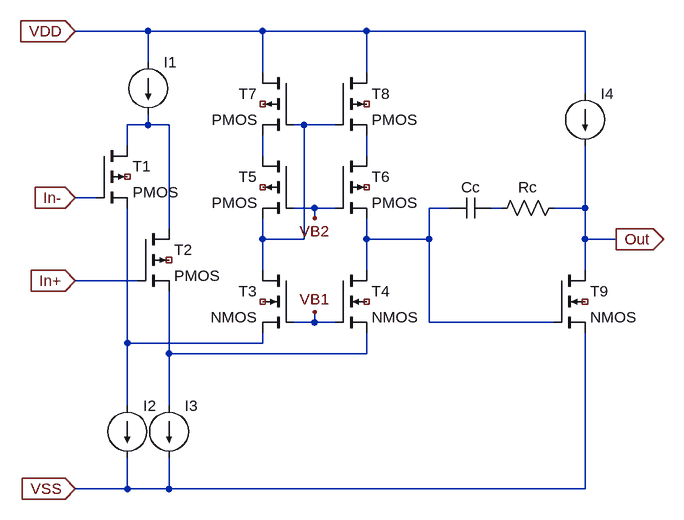
[diagram p0: schematic topology.asc]
topology.asc, the LTspice schematic file:
Version 4
SHEET 1 1204 680
WIRE 384 -176 272 -176
WIRE 560 -176 384 -176
WIRE 720 -176 560 -176
WIRE 1056 -176 720 -176
WIRE 384 -128 384 -176
WIRE 560 -112 560 -176
WIRE 720 -112 720 -176
WIRE 1056 -80 1056 -176
WIRE 384 -32 384 -48
WIRE 384 -32 352 -32
WIRE 416 -32 384 -32
WIRE 624 -32 608 -32
WIRE 672 -32 624 -32
WIRE 352 0 352 -32
WIRE 560 16 560 -16
WIRE 720 16 720 -16
WIRE 304 80 272 80
WIRE 640 96 608 96
WIRE 672 96 640 96
WIRE 848 96 816 96
WIRE 928 96 912 96
WIRE 1056 96 1056 0
WIRE 1056 96 1008 96
WIRE 640 112 640 96
WIRE 416 128 416 -32
WIRE 560 144 560 112
WIRE 624 144 624 -32
WIRE 624 144 560 144
WIRE 720 144 720 112
WIRE 816 144 816 96
WIRE 816 144 720 144
WIRE 1056 144 1056 96
WIRE 1104 144 1056 144
WIRE 560 192 560 144
WIRE 720 192 720 144
WIRE 1056 192 1056 144
WIRE 368 208 272 208
WIRE 640 272 640 256
WIRE 640 272 608 272
WIRE 672 272 640 272
WIRE 816 272 816 144
WIRE 1008 272 816 272
WIRE 352 304 352 96
WIRE 560 304 560 288
WIRE 560 304 352 304
WIRE 416 320 416 224
WIRE 720 320 720 288
WIRE 720 320 416 320
WIRE 352 400 352 304
WIRE 416 400 416 320
WIRE 352 528 352 480
WIRE 352 528 272 528
WIRE 416 528 416 480
WIRE 416 528 352 528
WIRE 1056 528 1056 288
WIRE 1056 528 416 528
FLAG 640 256 VB1
FLAG 640 112 VB2
FLAG 272 -176 VDD
IOPIN 272 -176 In
FLAG 272 528 VSS
IOPIN 272 528 In
FLAG 1104 144 Out
IOPIN 1104 144 Out
FLAG 272 208 In+
IOPIN 272 208 In
FLAG 272 80 In-
IOPIN 272 80 In
SYMBOL pmos4 304 0 R0
SYMATTR InstName T1
SYMBOL pmos4 368 128 R0
SYMATTR InstName T2
SYMBOL pmos4 672 16 R0
SYMATTR InstName T6
SYMBOL pmos4 608 16 M0
SYMATTR InstName T5
SYMBOL pmos4 608 -112 M0
SYMATTR InstName T7
SYMBOL pmos4 672 -112 R0
SYMATTR InstName T8
SYMBOL nmos4 608 192 M0
SYMATTR InstName T3
SYMBOL nmos4 672 192 R0
SYMATTR InstName T4
SYMBOL nmos4 1008 192 R0
SYMATTR InstName T9
SYMBOL current 1056 -80 R0
SYMATTR InstName I4
SYMATTR Value ""
SYMBOL current 352 400 R0
SYMATTR InstName I2
SYMATTR Value ""
SYMBOL current 416 400 R0
SYMATTR InstName I3
SYMATTR Value ""
SYMBOL current 384 -128 R0
SYMATTR InstName I1
SYMATTR Value ""
SYMBOL res 1024 80 R90
WINDOW 0 0 56 VBottom 2
WINDOW 3 32 56 VTop 2
SYMATTR InstName Rc
SYMATTR Value ""
SYMBOL cap 912 80 R90
WINDOW 0 0 32 VBottom 2
WINDOW 3 32 32 VTop 2
SYMATTR InstName Cc
SYMATTR Value ""

The netlist it stands for:
* topology.asc
M§T1 N001 In- N007 NC_01 PMOS
M§T2 N001 In+ N008 NC_02 PMOS
M§T6 N004 VB2 N005 NC_03 PMOS
M§T5 N003 VB2 N002 NC_04 PMOS
M§T7 VDD N002 N003 NC_05 PMOS
M§T8 VDD N002 N004 NC_06 PMOS
M§T3 N002 VB1 N007 NC_07 NMOS
M§T4 N005 VB1 N008 NC_08 NMOS
M§T9 Out N005 VSS NC_09 NMOS
I4 VDD Out
I2 N007 VSS
I3 N008 VSS
I1 VDD N001
Rc Out N006
Cc N006 N005
.model NMOS NMOS
.model PMOS PMOS
.lib standard.mos
.backanno
.end